# EasyEDA schematic SCH.json
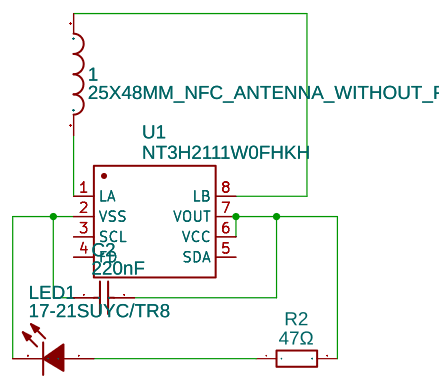
[diagram p0: schematic sheet]

## Parts
1  25X48MM_NFC_ANTENNA_WITHOUT_PADS  [25X48MM_NFC_ANTENNA]
C2  220nF  [C0603]
LED1  17-21SUYC/TR8  [LED0805-R-RD]
R2  47Ω  [R0603]
U1  NT3H2111W0FHKH  [XQFN-8_L1.6-W1.6-P0.50-BL_NT3H2111W0FHKH]

## Library data of the parts
1 = 25X48MM_NFC_ANTENNA_WITHOUT_PADS: Contributor: ThijsH
C2 = CL10B224KA8NNNC: Supplier: LCSC; Manufacturer: SAMSUNG(三星); Supplier Part: C21120; JLCPCB Part Class: Basic Part
LED1 = 17-21SUYC/TR8: Supplier: LCSC; Manufacturer: KENTO; Manufacturer Part: KT-0805黄灯; Supplier Part: C2296; JLCPCB Part Class: Basic Part
R2 = 0603WAF470JT5E: Supplier: LCSC; Manufacturer: UNI-ROYAL(厚声); Supplier Part: C23182; JLCPCB Part Class: Basic Part
U1 = NT3H2111W0FHKH: Contributor: LCSC; Supplier: LCSC; Supplier Part: C710403; Manufacturer: NXP(恩智浦); JLCPCB Part Class: Extended Part

## Nets
Net-(1-P$1): 1.P$1 U1.8(LB)
Net-(1-P$2): 1.P$2 U1.1(LA)
Net-(C2-1): C2.1 LED1.2(-) U1.2(VSS)
Net-(C2-2): C2.2 R2.2 U1.6(VCC) U1.7(VOUT)
Net-(LED1-1): LED1.1(+) R2.1

Not connected (* = marked no-connect by the designer): U1 3(SCL) 4(FD) 5(SDA)
